# EAGLE design Op-amp Microphone Preamp single-supply (EAGLE 6.2)
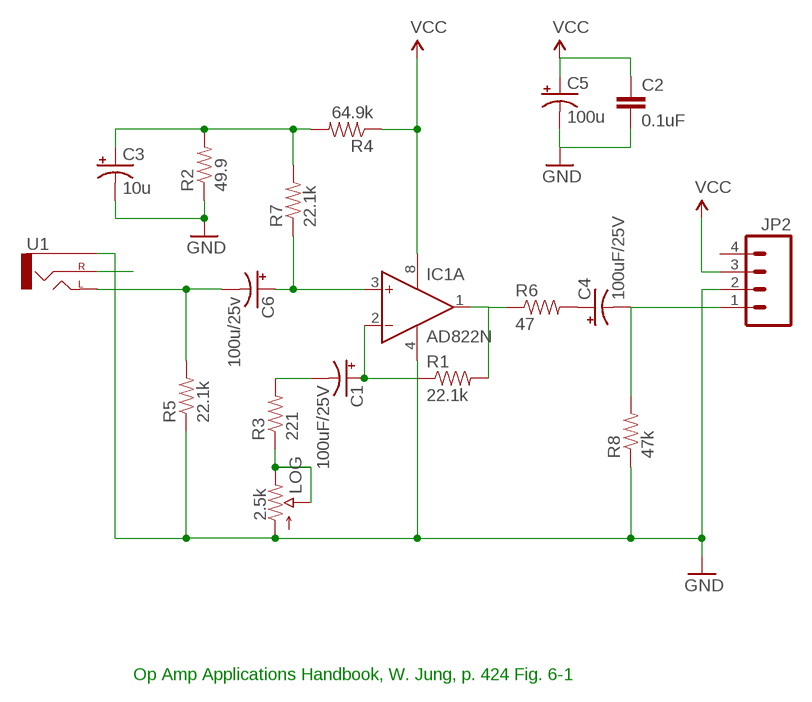
[diagram p0: schematic, sheet 1]

## Parts
C1  100uF/25V  CAP_POLPTH1  [CPOL-RADIAL-100UF-25V]
C2  0.1uF  CAPKIT  [CAP-PTH-SMALL-KIT]
C3  10u  CAP_POLPTH1  [CPOL-RADIAL-100UF-25V]
C4  100uF/25V  CAP_POLPTH1  [CPOL-RADIAL-100UF-25V]
C5  100u  CAP_POLPTH1  [CPOL-RADIAL-100UF-25V]
C6  100u/25v  CAP_POLPTH1  [CPOL-RADIAL-100UF-25V]
IC1  AD822N  [DIL08]
JP2  M04POLAR  [MOLEX-1X4]
LOG  2.5k  POT-RV16AF-20  [POT_ALPHA_RV16AF-20]
R1  22.1k  RESISTORPTH-1/6W  [1/6W-RES]
R2  49.9  RESISTORPTH-1/6W  [1/6W-RES]
R3  221  RESISTORPTH-1/6W  [1/6W-RES]
R4  64.9k  RESISTORPTH-1/6W  [1/6W-RES]
R5  22.1k  RESISTORPTH-1/6W  [1/6W-RES]
R6  47  RESISTORPTH-1/6W  [1/6W-RES]
R7  22.1k  RESISTORPTH-1/6W  [1/6W-RES]
R8  47k  RESISTORPTH-1/6W  [1/6W-RES]
U1  AUDIO-JACKPTH  [AUDIO-JACK]

## Nets
GND: C2.2 C3.2(-) C5.2(-) IC1.4(P:V-) JP2.2 LOG.1(A) R2.1 R5.1 R8.1 U1.SLEEVE
N$1: C3.1(+) R2.2 R4.2 R7.2
N$2: C1.2(-) R3.2
N$3: IC1.1(A:OUT) R1.2 R6.1
N$4: LOG.2(S) LOG.3(E) R3.1
N$5: C1.1(+) IC1.2(A:IN-) R1.1
N$6: C6.1(+) IC1.3(A:IN+) R7.1
N$7: C4.1(+) R6.2
N$8: C6.2(-) R5.2 U1.TIP(LEFT)
N$9: U1.RING(RIGHT)
N$13: C4.2(-) JP2.1 R8.2
VCC: C2.1 C5.1(+) IC1.8(P:V+) JP2.3 R4.1
Unconnected: IC1.5(B:IN+) IC1.6(B:IN-) IC1.7(B:OUT) JP2.4

## Notes on the sheet
- Op Amp Applications Handbook, W. Jung, p. 424 Fig. 6-1

## Library data of the parts
C1 C3-C6 = SparkFun:CAP_POL: Capacitor Polarized These are standard SMD and PTH capacitors. Normally 10uF, 47uF, and 100uF in electrolytic and tantalum varieties. Always verify the external diameter of the through hole cap, it varies with capacity, voltage, and manufacturer. The EIA devices should be standard.
C2 = SparkFun:CAP: Capacitor Standard 0603 ceramic capacitor, and 0.1" leaded capacitor.
IC1 = analog-devices:AD822: Single-Supply, Rail-to-Rail Low Power FET-Input Op Amp Source: http://www.analog.com/static/imported-files/data_sheets/AD822.pdf; OC_FARNELL: 1438581; OC_NEWARK: unknown
JP2 = SparkFun:M04: Header 4 Standard 4-pin 0.1" header. Use with straight break away headers (SKU : PRT-00116), right angle break away headers (PRT-00553), swiss pins (PRT-00743), machine pins (PRT-00117), and female headers (PRT-00115). Molex polarized connector foot print use with SKU : PRT-08231 with associated crimp pins and housings. 1MM SMD Version SKU: PRT-10208
LOG = My Library:POT
R1-R8 = My Library:RESISTOR: Resistor Basic schematic elements and footprints for 0603, 1206, and PTH resistors.
U1 = SparkFun:AUDIO-JACK: 3.5mm Audio Jack Simple 3.5mm common PCB mount audio jack. SKU: PRT-08032

## Board
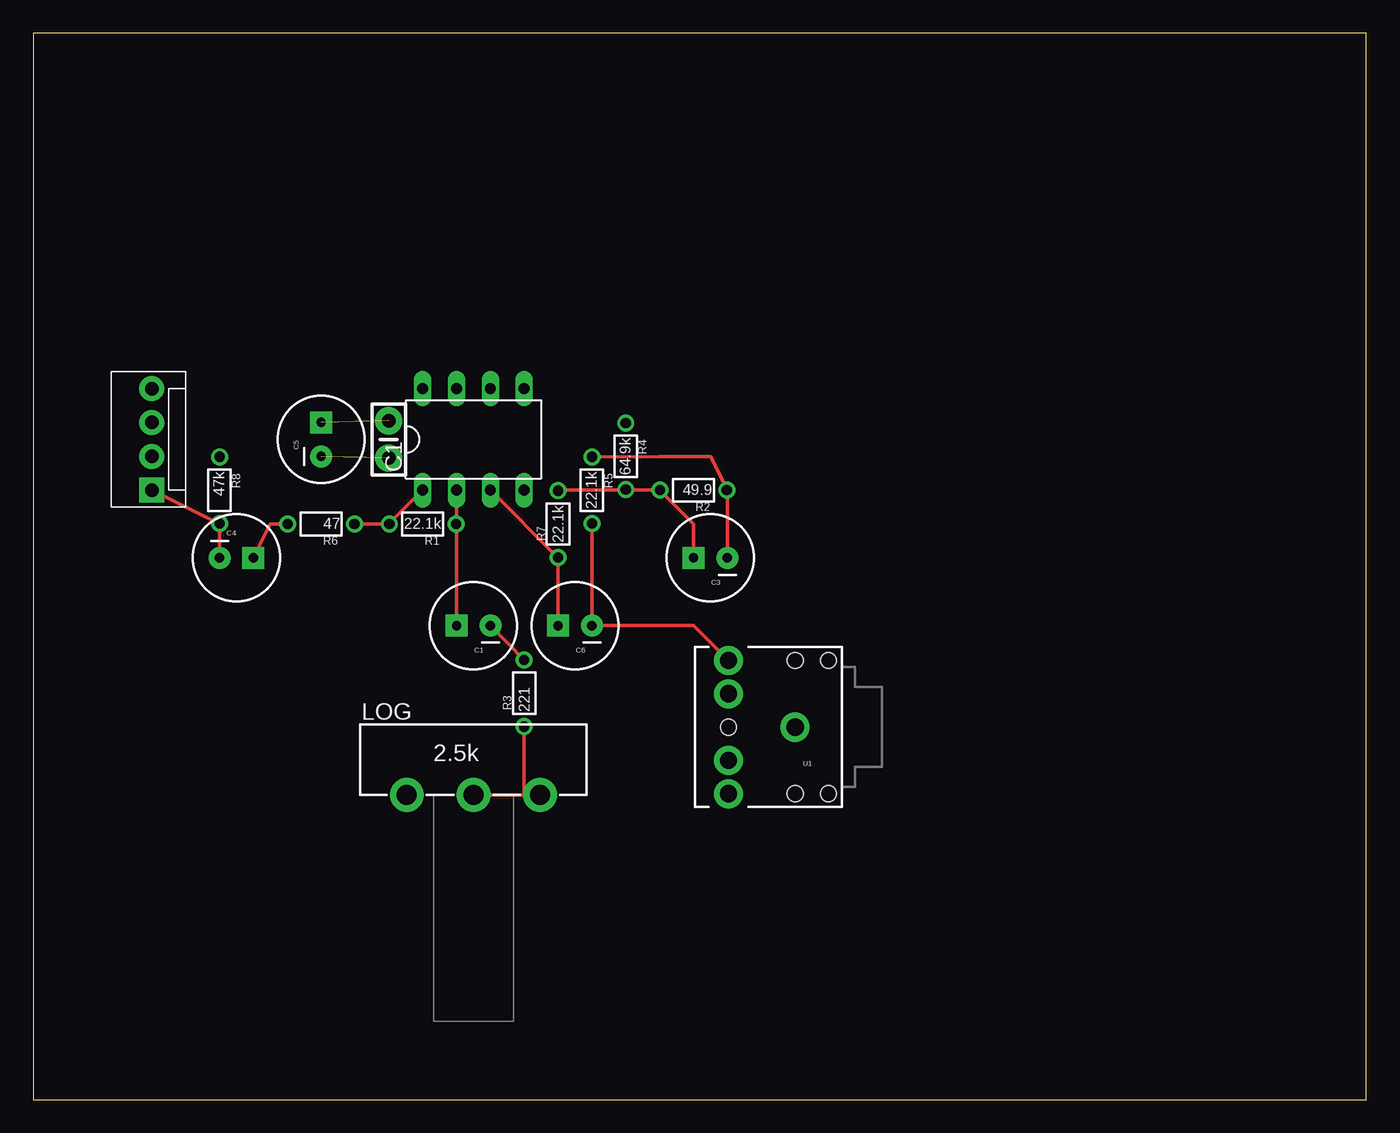
[diagram p1: board, top side]
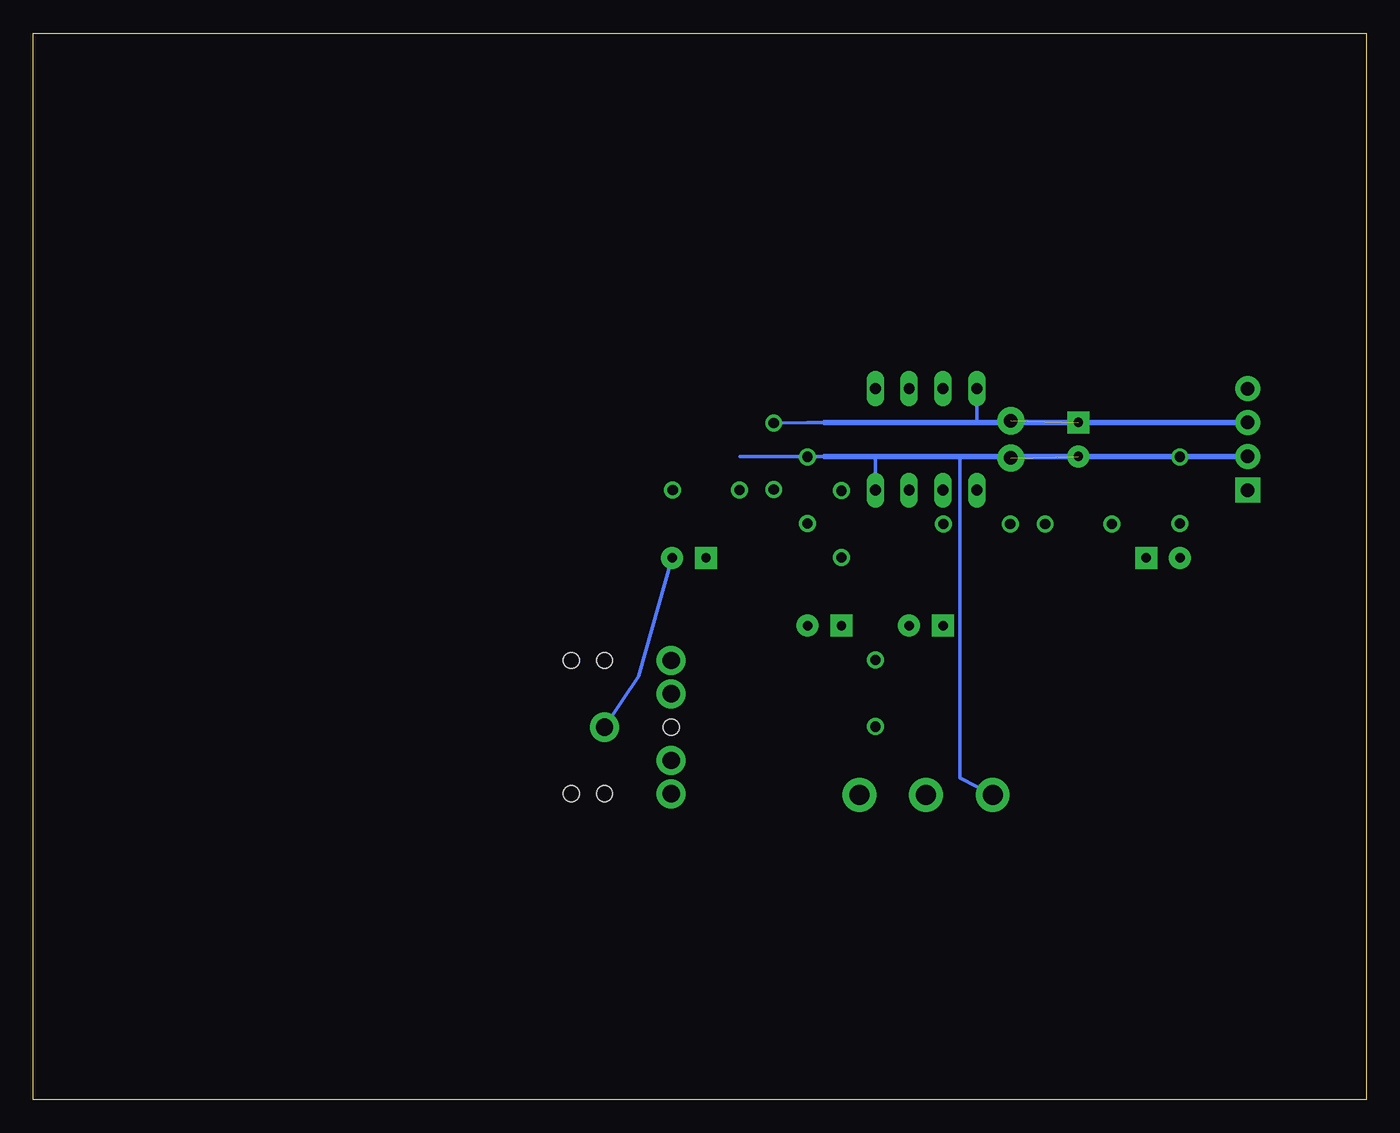
[diagram p2: board, bottom side, seen from below]

Size 100 x 80 mm. Coordinates in mm from the lower left corner, seen from the top.
Outline: 0,0 100,0 100,80 0,80 0,0
Copper layers (1*16): Top 0.035mm / dielectric 1.5mm / Bottom 0.035mm
Design rules: minimum track width 10mil, minimum drill 24mil, track to track 8mil, track to pad 8mil, pad to pad 8mil, via to via 8mil, smd to smd 8mil, copper to edge 40mil, drill to drill 8mil, minimum pad ring 10mil, minimum via ring 8mil, stop-mask expansion 4mil, vias tented up to drill 0mil, thermal gap 10mil

### Footprints (pad centres in the part's own frame; a part is rotated, then mirrored left to right if it is on the bottom)
CPOL-RADIAL-100UF-25V = drill 0.7 pad 1.651 square: 1 1.27,0 | drill 0.7 pad 1.651: 2 -1.27,0
CAP-PTH-SMALL-KIT = drill 1.016 pad 2.032: 1 -1.397,0; 2 1.397,0
DIL08 = drill 0.813 long: 1 -3.81,-3.81; 2 -1.27,-3.81; 3 1.27,-3.81; 4 3.81,-3.81; 5 3.81,3.81; 6 1.27,3.81; 7 -1.27,3.81; 8 -3.81,3.81
MOLEX-1X4 = drill 1.016 pad 1.88 square: 1 0,0 | drill 1.016 pad 1.88: 2 2.54,0; 3 5.08,0; 4 7.62,0
POT_ALPHA_RV16AF-20 = drill 1.5 pad 2.54: 1 -5,0; 2 0,0; 3 5,0
1/6W-RES = drill 0.762: 1 -2.5,0; 2 2.5,0
AUDIO-JACK = drill 1.3 pad 2.184: RING 5,5; RSH 5,2.5; SLEEVE 0,0; TIP 5,-5; TSH 5,-2.5 | hole 1.2: 0,5; -2.5,5; -2.5,-5; 0,-5; 5,0

### Placement (x,y rotation side)
C1  33.02,35.56 180 top
C2  26.67,49.53 270 top
C3  50.8,40.64 180 top
C4  15.24,40.64 0 top
C5  21.59,49.53 90 top
C6  40.64,35.56 180 top
IC1  33.02,49.53 0 top
JP2  8.89,45.72 90 top
LOG  33.02,22.86 0 top
R1  29.21,43.18 180 top
R2  49.53,45.72 180 top
R3  36.83,30.48 90 top
R4  44.45,48.26 270 top
R5  41.91,45.72 270 top
R6  21.59,43.18 180 top
R7  39.37,43.18 90 top
R8  13.97,45.72 270 top
U1  57.15,27.94 180 top

### Tracks (layer width: path | path; a pad name or v marks a point on that pad's centre or on a via)
GND  (1 unrouted)
  Top 0.254: C3.2 52.07,45.72 | 52.07,45.72 R2.1 52.07,45.72 | 52.07,45.72 50.8,48.26 46.99,48.26 R5.1
  Bottom 0.254: C3.2 54.61,31.75 U1.SLEEVE | 13.97,48.26 R8.1 | 26.67,48.26 C2.2 | 36.83,48.26 IC1.4 | 40.64,48.26 46.99,48.26 R5.1 | 30.48,48.26 30.48,24.13 LOG.1
  Bottom 0.406: JP2.2 13.97,48.26 26.67,48.26 30.48,48.26 36.83,48.26 40.64,48.26
N$1
  Top 0.254: 41.91,45.72 39.37,45.72 R7.2 | 41.91,45.72 R4.2 41.91,45.72 | 46.99,45.72 49.53,43.18 C3.1 | 46.99,45.72 R2.2 46.99,45.72 | 46.99,45.72 41.91,45.72
N$2
  Top 0.254: C1.2 R3.2
N$3
  Top 0.254: 26.67,43.18 24.13,43.18 R6.1 | 26.67,43.18 R1.2 26.67,43.18 | 26.67,43.18 IC1.1
N$4
  Top 0.254: 36.83,22.86 36.83,27.94 R3.1 | 36.83,22.86 LOG.3 36.83,22.86 | 36.83,22.86 LOG.2
N$5
  Top 0.254: IC1.2 31.75,43.18 | 31.75,43.18 R1.1 31.75,43.18 | 31.75,43.18 C1.1
N$6
  Top 0.254: C6.1 39.37,39.37 R7.1 39.37,40.64 IC1.3
N$7
  Top 0.254: C4.1 17.78,43.18 R6.2
N$8
  Top 0.254: R5.2 41.91,40.64 C6.2 48.26,35.56 49.53,35.56 U1.TIP
N$13
  Top 0.254: C4.2 13.97,43.18 | 13.97,43.18 R8.2 13.97,43.18 | 13.97,43.18 JP2.1
VCC  (1 unrouted)
  Bottom 0.254: 40.64,50.8 41.91,50.8 R4.1 | 26.67,50.8 C2.1 | 29.21,50.8 IC1.8
  Bottom 0.406: JP2.3 26.67,50.8 29.21,50.8 40.64,50.8